# Altium schematic sheet CAN_IC.SchDoc
size A; SheetNumber: 5; SheetTotal: 8
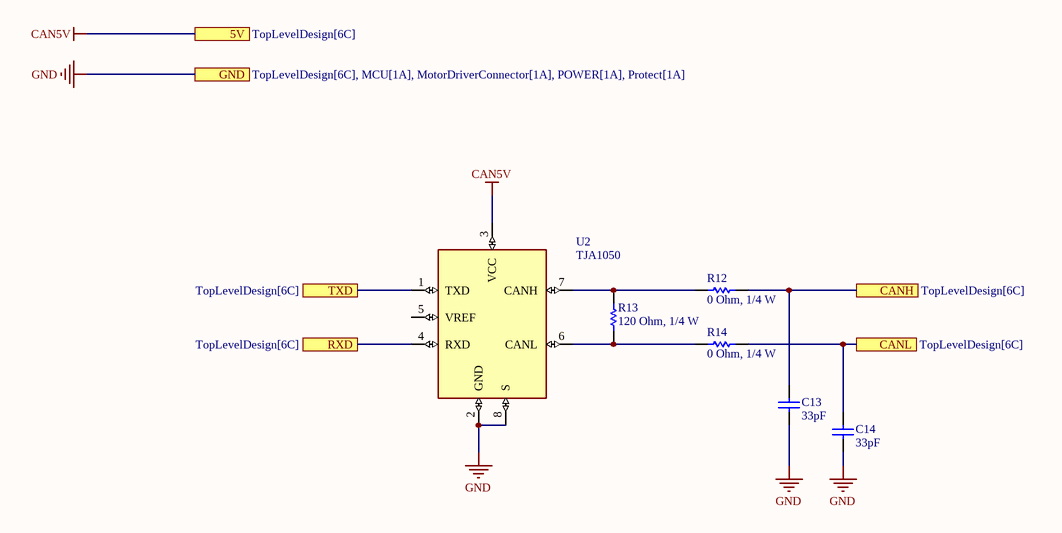
[diagram p0: CAN_IC.SchDoc]

## Parts
C13  value 33pF  [CAP_0603]  (hidden comment: 0106033300550)
C14  value 33pF  [CAP_0603]  (hidden comment: 0106033300550)
R12  value 0 Ohm, 1/4 W  [resistor_0603]  (hidden comment: 0006030001)
R13  value 120 Ohm, 1/4 W  [resistor_0603]  (hidden comment: 0006031211)
R14  value 0 Ohm, 1/4 W  [resistor_0603]  (hidden comment: 0006030001)
U2  TJA1050  [SOP8]

## Ports
5V (see TopLevelDesign[6C]), CANH (see TopLevelDesign[6C]), CANL (see TopLevelDesign[6C]), GND (see TopLevelDesign[6C], MCU[1A], MotorDriverConnector[1A], POWER[1A], Protect[1A]), RXD (see TopLevelDesign[6C]), TXD (see TopLevelDesign[6C])

## Nets
CAN5V: U2.3(VCC) ; port 5V
GND: C13.1 C14.1 U2.2(GND) U2.8(S) ; port GND
CANH: C13.2 R12.2 ; port CANH
CANL: C14.2 R14.2 ; port CANL
RXD: U2.4(RXD) ; port RXD
TXD: U2.1(TXD) ; port TXD
NetR12_1: R12.1 R13.2 U2.7(CANH)
NetR13_1: R13.1 R14.1 U2.6(CANL)

Not connected (* = marked no-connect by the designer): U2 5(VREF)

## Library data of the parts
C13 C14 = CMP-001-00238-1: CAP, size 0603, 33 pF, 50 VDC; Manufacture SN: CGA3E2NP01H330J080AA; Manufacture Name: TDK; Tolerance: 5%; Voltage Rating DC: 50 VDC; Design Item ID: 0106033300550; Operating Temperature: -55 to +125degC; Supplier 1 URL: https://www.mouser.com/ProductDetail/TDK/CGA3E2NP01H330J080AA?qs=xLDY6iXSiQZLs28ZlT4aFg%3D%3D&utm_source=mouser-refine-download&utm_medium=file&utm_campaign=CGA3E2NP01H330J080AA&utm_content=TDK; Size: 0603; Source: Capacitor_0603_5_percent.SchLib; Supplier 2 Name: Digi-Key; Packaging: Tape and Reel; Supplier 3 Name: thegioiic; Supplier 3 SN: N/A; Component Type: Standard; Pins: 2; Supplier 2 SN: 445-12409-2-ND; Mounting Technology: SMT; Supplier 1 Name: Mouser; Supplier 1 SN: 810-CGA3E2NP01H330JA; Supplier 2 URL: https://www.digikey.com/en/products/detail/tdk-corporation/cga3e2np01h330j080aa/3949645; Supplier 3 URL: N/A
R12 R14 = CMP-009-00180-1: RES, size 0603, 0 Ohm, 1/4 W; Manufacture  Name: YAGEO; Manufacture  SN: AC0603FR-070RL; Resistance Tolerance: +/-1%; Rated Power: 1/4 W; Pins: 2; ComponentLink1Description: Datasheet link; ComponentLink4URL: N/A; Component Type: Standard; ComponentLink2URL: N/A; Supplier 2 URL: https://www.digikey.com/en/products/detail/yageo/ac0603fr-070rl/2827812; Supplier 1 Name: Mouser; Supplier 1 SN: 603-AC0603FR-070RL; ComponentLink1URL: https://www.mouser.com/datasheet/2/447/Yageo_06282023_ACseries-3224032.pdf; Mounting Technology: SMT; ComponentLink2Description: Supplier 1 URL; Size: 0603; Supplier 2 SN: 311-0.0LDTR-ND; ComponentLink4Description: Supplier 3 URL; ComponentLink3URL: https://www.digikey.com/en/products/detail/yageo/ac0603fr-070rl/2827812; ComponentLink3Description: Supplier 2 URL; Supplier 3 Name: thegioiic; Supplier 3 SN: N/A; Supplier 2 Name: Digi-Key; Source: Resistor_0603.SchLib; Design Item ID: 0006030001; Supplier 3 URL: https://www.thegioiic.com/dien-tro-0-ohm-0603-1-; Supplier 1 URL: https://www.mouser.com/ProductDetail/YAGEO/AC0603FR-070RL?qs=sGAEpiMZZMtlubZbdhIBIOG3KwTtqrl%2FD2D%252BGuMCfoY%3D
R13 = CMP-009-00207-1: RES, size 0603, 120 Ohm, 1/4 W; Manufacture  SN: OEM; Resistance Tolerance: +/-1%; Rated Power: 1/4 W; Supplier 2 Name: Digi-Key; Supplier 1 Name: Mouser; ComponentLink4Description: Supplier 3 URL; ComponentLink3URL: https://www.digikey.com/en/products/detail/yageo/SR0603FR-7T120RL/9373099; Supplier 1 SN: 603-SR0603FR-7T120RL; Supplier 1 URL: https://www.mouser.vn/ProductDetail/YAGEO/SR0603FR-7T120RL?qs=sGAEpiMZZMvdGkrng054tz1y1XEHv7sNpzSbq0ZWZmOggb8s%252BZMxlg%3D%3D; Component Type: Standard; ComponentLink3Description: Supplier 2 URL; Design Item ID: 0006031211; ComponentLink2URL: N/A; Pins: 2; Mounting Technology: SMT; ComponentLink2Description: Supplier 1 URL; Supplier 3 URL: N/A; Supplier 2 SN: YAG5825TR-ND YAG5825CT-ND YAG5825DKR-ND; Manufacture  Name: OEM; Supplier 3 Name: thegioiic; ComponentLink1URL: https://www.yageo.com/upload/media/product/productsearch/datasheet/rchip/PYu-SR_20105_RoHS_L_10.pdf; ComponentLink4URL: N/A; Supplier 2 URL: https://www.digikey.com/en/products/detail/yageo/SR0603FR-7T120RL/9373099; Size: 0603; ComponentLink1Description: Datasheet link; Source: Resistor_0603.SchLib; Supplier 3 SN: N/A
U2 = CMP-016-000000-1: 1/1 Transceiver Half CANbus 8-SO; MF: NXP USA; MP: TJA1050; Value: *; Purchase-URL: https://pricing.snapeda.com/search/part/TJA1050/?ref=eda; SnapEDA_Link: https://www.snapeda.com/parts/TJA1050/NXP%20USA%20Inc./view-part/562764/?ref=snap; Price: None; Check_prices: https://www.snapeda.com/parts/TJA1050/NXP%20USA%20Inc./view-part/562764/?ref=eda; Availability: In Stock; Source: TJA1050.SchLib; Design Item ID: TJA1050; Package: SOIC-8 NXP Semiconductors